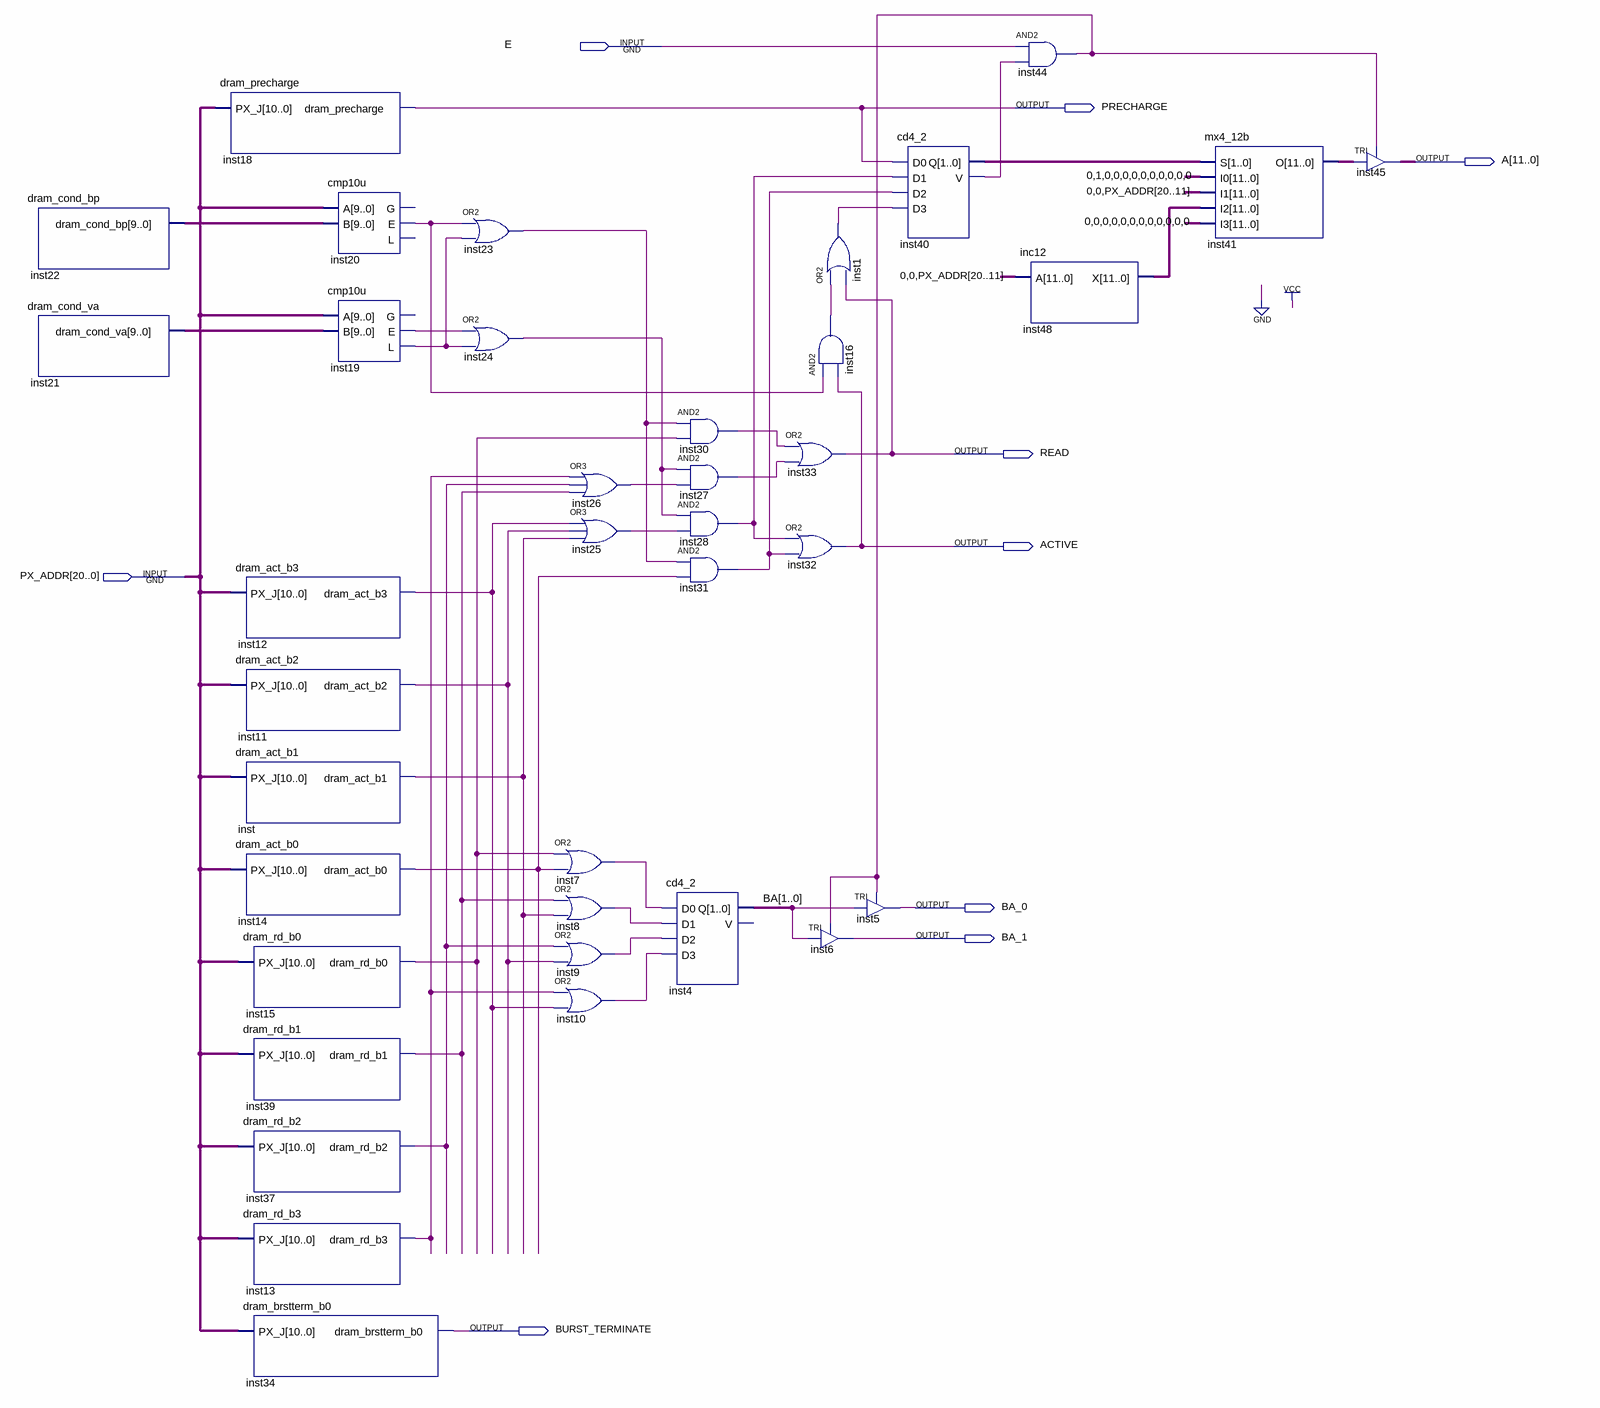
[diagram p0: schematic sheet]
// Quartus schematic rtc.bdf as structural Verilog: 38 symbols, 9 pins
module rtc (
  input  E,
  input  [20:0] PX_ADDR,
  output PRECHARGE,
  output [11:0] A,
  output READ,
  output ACTIVE,
  output BA_0,
  output BA_1,
  output BURST_TERMINATE
);

  wire inst1_out, inst7_out, inst8_out, inst9_out, inst10_out, inst11_dram_act_b2, inst12_dram_act_b3,
       inst13_dram_rd_b3, inst14_dram_act_b0, inst15_dram_rd_b0, inst16_out, inst19_e, inst19_l, inst20_e,
       inst23_out, inst24_out, inst25_out, inst26_out, inst27_out, inst28_out, inst30_out, inst31_out,
       inst37_dram_rd_b2, inst39_dram_rd_b1, inst40_v, inst44_out, inst_dram_act_b1;
  wire [1:0] BA, inst40_q;
  wire [9:0] inst21_dram_cond_va, inst22_dram_cond_bp;
  wire [11:0] inst41_o, inst48_x;

  dram_cond_bp inst22 (.dram_cond_bp(inst22_dram_cond_bp));
  dram_cond_va inst21 (.dram_cond_va(inst21_dram_cond_va));
  dram_precharge inst18 (.PX_J(PX_ADDR[10:0]), .dram_precharge(PRECHARGE));
  dram_act_b3 inst12 (.PX_J(PX_ADDR[10:0]), .dram_act_b3(inst12_dram_act_b3));
  dram_act_b2 inst11 (.PX_J(PX_ADDR[10:0]), .dram_act_b2(inst11_dram_act_b2));
  dram_act_b1 inst (.PX_J(PX_ADDR[10:0]), .dram_act_b1(inst_dram_act_b1));
  dram_act_b0 inst14 (.PX_J(PX_ADDR[10:0]), .dram_act_b0(inst14_dram_act_b0));
  dram_rd_b0 inst15 (.PX_J(PX_ADDR[10:0]), .dram_rd_b0(inst15_dram_rd_b0));
  dram_rd_b1 inst39 (.PX_J(PX_ADDR[10:0]), .dram_rd_b1(inst39_dram_rd_b1));
  dram_rd_b2 inst37 (.PX_J(PX_ADDR[10:0]), .dram_rd_b2(inst37_dram_rd_b2));
  dram_rd_b3 inst13 (.PX_J(PX_ADDR[10:0]), .dram_rd_b3(inst13_dram_rd_b3));
  dram_brstterm_b0 inst34 (.PX_J(PX_ADDR[10:0]), .dram_brstterm_b0(BURST_TERMINATE));
  cmp10u inst20 (.A(PX_ADDR[20:11]), .B(inst22_dram_cond_bp), .E(inst20_e));  // open: G, L
  cmp10u inst19 (.A(PX_ADDR[20:11]), .B(inst21_dram_cond_va), .E(inst19_e), .L(inst19_l));  // open: G
  or inst23 (inst23_out, inst20_e, inst19_l);
  or inst24 (inst24_out, inst19_e, inst19_l);
  or inst26 (inst26_out, inst13_dram_rd_b3, inst37_dram_rd_b2, inst39_dram_rd_b1);
  or inst25 (inst25_out, inst12_dram_act_b3, inst11_dram_act_b2, inst_dram_act_b1);
  or inst7 (inst7_out, inst15_dram_rd_b0, inst14_dram_act_b0);
  or inst8 (inst8_out, inst39_dram_rd_b1, inst_dram_act_b1);
  or inst9 (inst9_out, inst37_dram_rd_b2, inst11_dram_act_b2);
  or inst10 (inst10_out, inst13_dram_rd_b3, inst12_dram_act_b3);
  and inst30 (inst30_out, inst23_out, inst15_dram_rd_b0);
  and inst27 (inst27_out, inst24_out, inst26_out);
  and inst28 (inst28_out, inst24_out, inst25_out);
  and inst31 (inst31_out, inst23_out, inst14_dram_act_b0);
  cd4_2 inst4 (.D0(inst7_out), .D1(inst8_out), .D2(inst9_out), .D3(inst10_out), .Q(BA));  // open: V
  or inst1 (inst1_out, inst16_out, READ);
  and inst16 (inst16_out, inst20_e, ACTIVE);
  or inst33 (READ, inst30_out, inst27_out);
  or inst32 (ACTIVE, inst28_out, inst31_out);
  TRI inst6 (.IN(BA[1]), .OE(inst44_out), .OUT(BA_1));
  TRI inst5 (.IN(BA[0]), .OE(inst44_out), .OUT(BA_0));
  cd4_2 inst40 (.D0(PRECHARGE), .D1(inst28_out), .D2(inst31_out), .D3(inst1_out), .Q(inst40_q), .V(inst40_v));
  and inst44 (inst44_out, E, inst40_v);
  inc12 inst48 (.A({2'b00, PX_ADDR[20:11]}), .X(inst48_x));
  mx4_12b inst41 (
    .S(inst40_q), .I0(12'b010000000000), .I1({2'b00, PX_ADDR[20:11]}), .I2(inst48_x), .I3({12{1'b0}}),
    .O(inst41_o));
  TRI inst45[11:0] (.IN(inst41_o), .OE(inst44_out), .OUT(A));
endmodule
